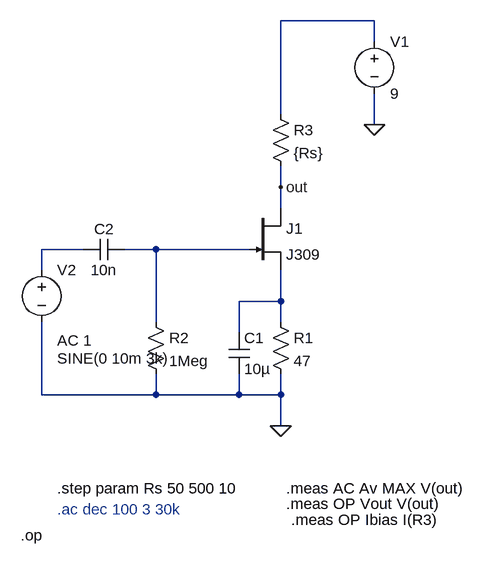
[diagram p0: schematic preamp.asc]
preamp.asc, the LTspice schematic file:
Version 4
SHEET 1 880 680
WIRE 464 -128 320 -128
WIRE 464 -96 464 -128
WIRE 320 16 320 -128
WIRE 464 32 464 -16
WIRE 320 128 320 96
WIRE 320 160 320 128
WIRE 16 224 -48 224
WIRE 128 224 80 224
WIRE 272 224 128 224
WIRE -48 256 -48 224
WIRE 320 304 320 256
WIRE 320 304 256 304
WIRE 128 336 128 224
WIRE 320 336 320 304
WIRE 256 352 256 304
WIRE -48 448 -48 336
WIRE 128 448 128 416
WIRE 128 448 -48 448
WIRE 256 448 256 416
WIRE 256 448 128 448
WIRE 320 448 320 416
WIRE 320 448 256 448
WIRE 320 496 320 448
FLAG 320 496 0
FLAG 464 32 0
FLAG 320 128 out
SYMBOL njf 272 160 R0
SYMATTR InstName J1
SYMATTR Value J309
SYMBOL res 304 320 R0
SYMATTR InstName R1
SYMATTR Value 47
SYMBOL cap 240 352 R0
SYMATTR InstName C1
SYMATTR Value 10µ
SYMBOL res 112 320 R0
SYMATTR InstName R2
SYMATTR Value 1Meg
SYMBOL res 304 0 R0
SYMATTR InstName R3
SYMATTR Value {Rs}
SYMBOL voltage 464 -112 R0
WINDOW 123 0 0 Left 0
WINDOW 39 0 0 Left 0
SYMATTR InstName V1
SYMATTR Value 9
SYMBOL voltage -48 240 R0
WINDOW 3 24 152 Left 2
WINDOW 123 24 124 Left 2
WINDOW 39 0 0 Left 0
SYMATTR Value SINE(0 10m 3k)
SYMATTR Value2 AC 1
SYMATTR InstName V2
SYMBOL cap 80 208 R90
WINDOW 0 0 32 VBottom 2
WINDOW 3 32 32 VTop 2
SYMATTR InstName C2
SYMATTR Value 10n
TEXT -24 624 Left 2 ;.ac dec 100 3 30k
TEXT -24 592 Left 2 !.step param Rs 50 500 10
TEXT 328 592 Left 2 !.meas AC Av MAX V(out)
TEXT 328 616 Left 2 !.meas OP Vout V(out)
TEXT 336 640 Left 2 !.meas OP Ibias I(R3)
TEXT -80 664 Left 2 !.op

The netlist it stands for:
* preamp.asc
J1 out N003 N004 J309
R1 N004 0 47
C1 N004 0 10µ
R2 N003 0 1Meg
R3 N001 out {Rs}
V1 N001 0 9
V2 N002 0 SINE(0 10m 3k) AC 1
C2 N003 N002 10n
.model NJF NJF
.model PJF PJF
.lib standard.jft
* .ac dec 100 3 30k
.step param Rs 50 500 10
.meas AC Av MAX V(out)
.meas OP Vout V(out)
.meas OP Ibias I(R3)
.op
.backanno
.end